# EAGLE schematic SparkFun_IMU_Breakout_ICM-20948_v1 (EAGLE 9.7.0)
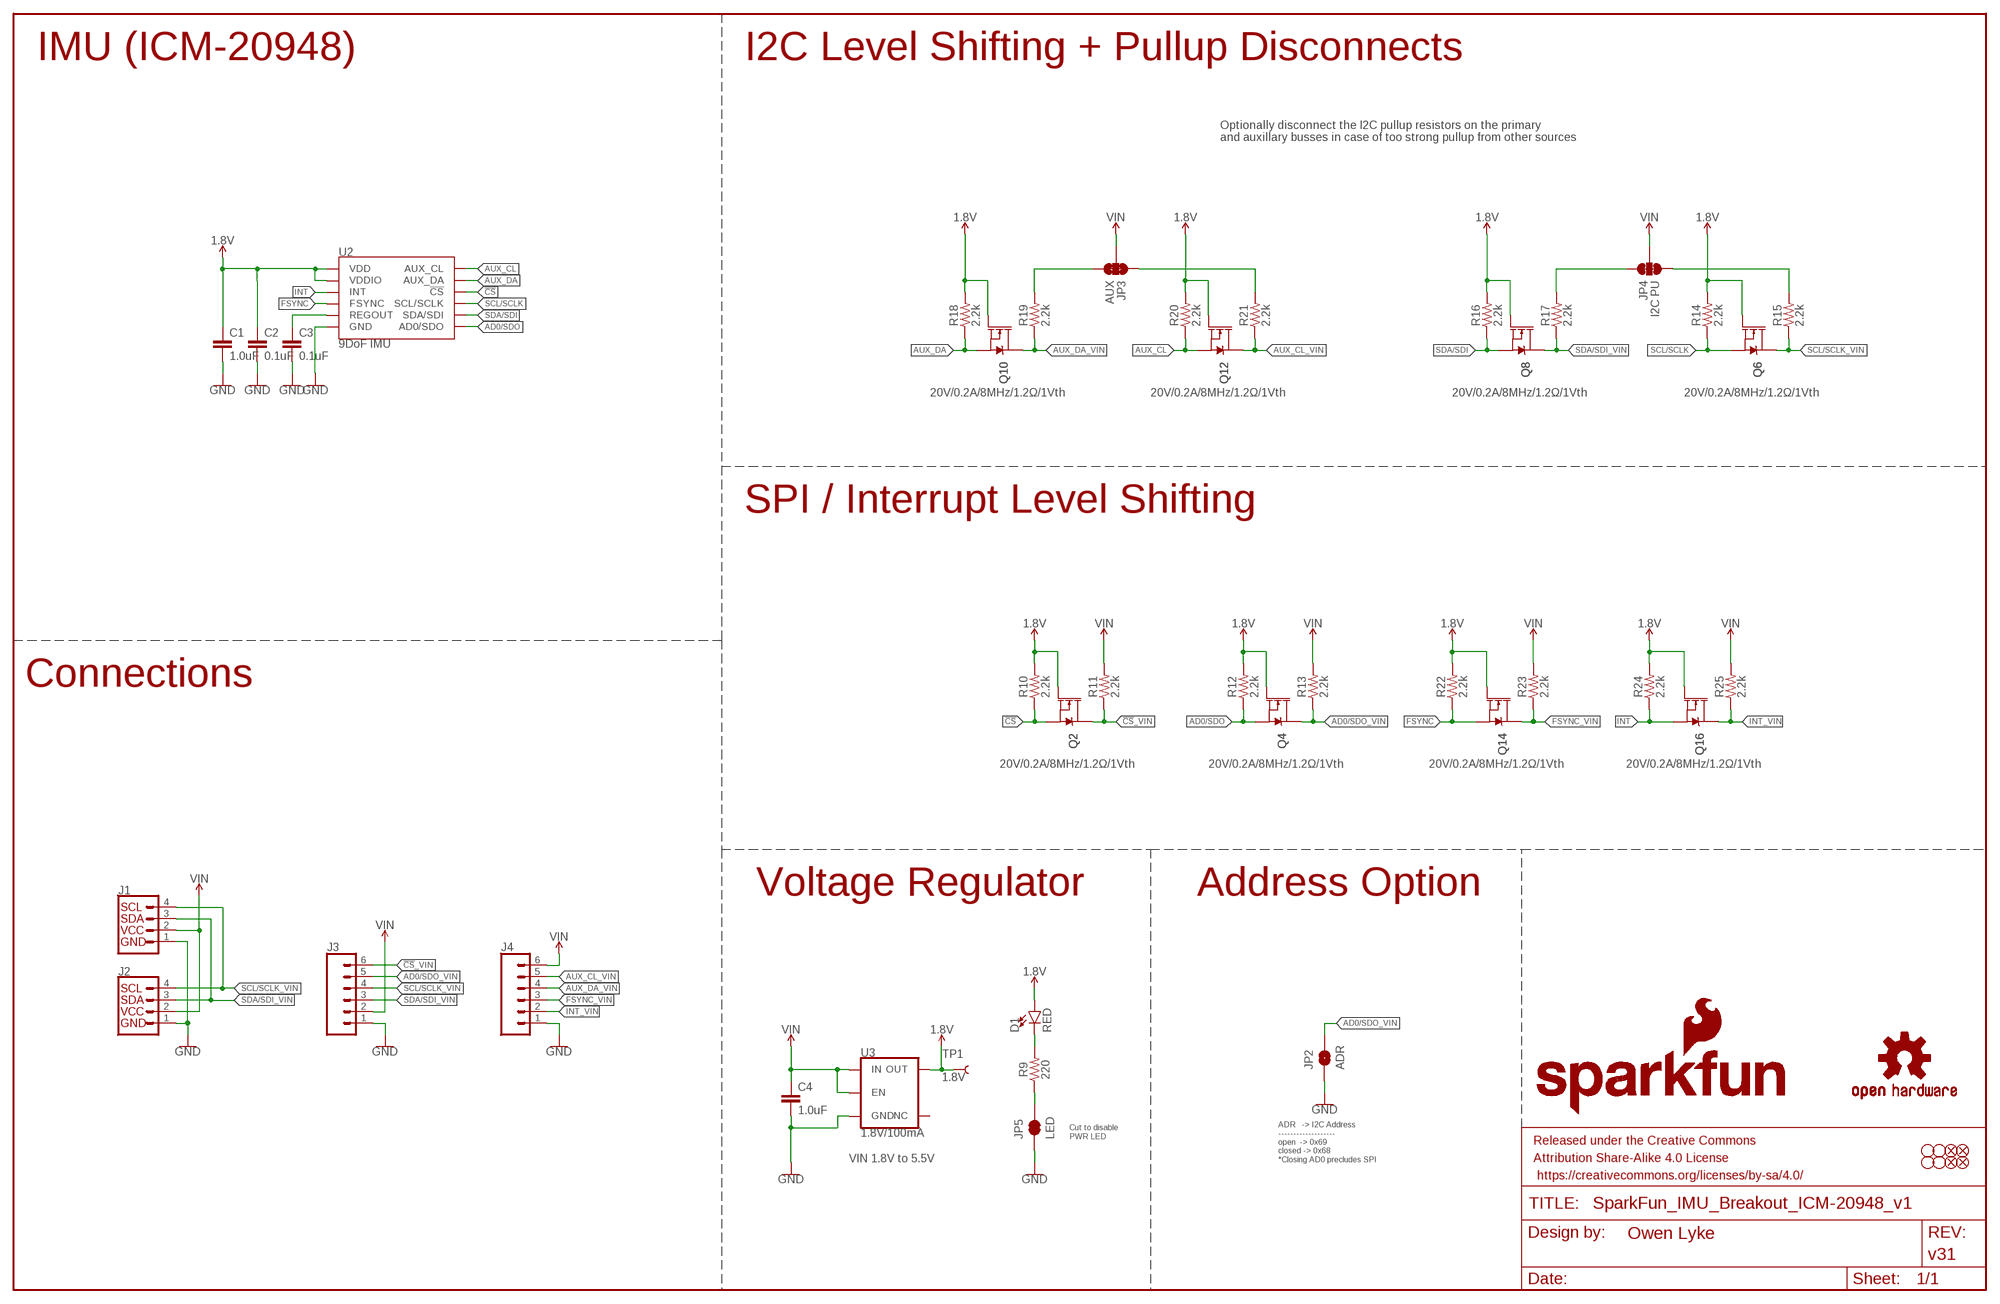
[diagram p0: schematic, sheet 1]

## Parts
C1  1.0uF  1.0UF-0603-16V-10%-X7R  [0603]
C2  0.1uF  0.1UF-0603-25V-5%  [0603]
C3  0.1uF  0.1UF-0603-25V-5%  [0603]
C4  1.0uF  1.0UF-0603-16V-10%-X7R  [0603]
D1  RED  LED-RED0603  [LED-0603]
FD1  FIDUCIAL1X2  [FIDUCIAL-1X2]
FD2  FIDUCIAL1X2  [FIDUCIAL-1X2]
FD3  FIDUCIAL1X2  [FIDUCIAL-1X2]
FD4  FIDUCIAL1X2  [FIDUCIAL-1X2]
FRAME2  FRAME-LEDGER  [CREATIVE_COMMONS]
H1  STAND-OFF  [STAND-OFF]
H2  STAND-OFF  [STAND-OFF]
H3  STAND-OFF  [STAND-OFF]
H4  STAND-OFF  [STAND-OFF]
J1  QWIIC_CONNECTORJS-1MM  [JST04_1MM_RA]
J2  QWIIC_CONNECTORJS-1MM  [JST04_1MM_RA]
J3  CONN_06NO_SILK_NO_POP  [1X06_NO_SILK]
J4  CONN_06NO_SILK_NO_POP  [1X06_NO_SILK]
JP2  ADR  JUMPER-SMT_2_NO_SILK  [SMT-JUMPER_2_NO_SILK]
JP3  AUX  JUMPER-SMT_3_2-NC_TRACE_SILK  [SMT-JUMPER_3_2-NC_TRACE_SILK]
JP4  I2C PU  JUMPER-SMT_3_2-NC_TRACE_SILK  [SMT-JUMPER_3_2-NC_TRACE_SILK]
JP5  LED  JUMPER-SMT_2_NC_TRACE_SILK  [SMT-JUMPER_2_NC_TRACE_SILK]
LOGO1  SFE_LOGO_NAME_FLAME.1_INCH  [SFE_LOGO_NAME_FLAME_.1]
LOGO2  OSHW-LOGOMINI  [OSHW-LOGO-MINI]
Q2  20V/0.2A/8MHz/1.2Ω/1Vth  MOSFET-NCH-RE1C002UN  [SOT-416FL]
Q4  20V/0.2A/8MHz/1.2Ω/1Vth  MOSFET-NCH-RE1C002UN  [SOT-416FL]
Q6  20V/0.2A/8MHz/1.2Ω/1Vth  MOSFET-NCH-RE1C002UN  [SOT-416FL]
Q8  20V/0.2A/8MHz/1.2Ω/1Vth  MOSFET-NCH-RE1C002UN  [SOT-416FL]
Q10  20V/0.2A/8MHz/1.2Ω/1Vth  MOSFET-NCH-RE1C002UN  [SOT-416FL]
Q12  20V/0.2A/8MHz/1.2Ω/1Vth  MOSFET-NCH-RE1C002UN  [SOT-416FL]
Q14  20V/0.2A/8MHz/1.2Ω/1Vth  MOSFET-NCH-RE1C002UN  [SOT-416FL]
Q16  20V/0.2A/8MHz/1.2Ω/1Vth  MOSFET-NCH-RE1C002UN  [SOT-416FL]
R9  220  220OHM-0603-1/10W-1%  [0603]
R10  2.2k  2.2KOHM-0402T-1/16W-1%  [0402-TIGHT]
R11  2.2k  2.2KOHM-0402T-1/16W-1%  [0402-TIGHT]
R12  2.2k  2.2KOHM-0402T-1/16W-1%  [0402-TIGHT]
R13  2.2k  2.2KOHM-0402T-1/16W-1%  [0402-TIGHT]
R14  2.2k  2.2KOHM-0402T-1/16W-1%  [0402-TIGHT]
R15  2.2k  2.2KOHM-0402T-1/16W-1%  [0402-TIGHT]
R16  2.2k  2.2KOHM-0402T-1/16W-1%  [0402-TIGHT]
R17  2.2k  2.2KOHM-0402T-1/16W-1%  [0402-TIGHT]
R18  2.2k  2.2KOHM-0402T-1/16W-1%  [0402-TIGHT]
R19  2.2k  2.2KOHM-0402T-1/16W-1%  [0402-TIGHT]
R20  2.2k  2.2KOHM-0402T-1/16W-1%  [0402-TIGHT]
R21  2.2k  2.2KOHM-0402T-1/16W-1%  [0402-TIGHT]
R22  2.2k  2.2KOHM-0402T-1/16W-1%  [0402-TIGHT]
R23  2.2k  2.2KOHM-0402T-1/16W-1%  [0402-TIGHT]
R24  2.2k  2.2KOHM-0402T-1/16W-1%  [0402-TIGHT]
R25  2.2k  2.2KOHM-0402T-1/16W-1%  [0402-TIGHT]
TP1  1.8V  TEST-POINT3  [PAD.03X.03]
U2  9DoF IMU  ICM-20948  [QFN24-3X3]
U3  1.8V/100mA  V_REG_SP6214-1.8V  [SC70]

## Nets
1.8V: C1.1 C2.1 D1.A Q2.1(G) Q4.1(G) Q6.1(G) Q8.1(G) Q10.1(G) Q12.1(G) Q14.1(G) Q16.1(G) R10.2 R12.2 R14.2 R16.2 R18.2 R20.2 R22.2 R24.2 TP1.P$1 U2.8(VDDIO) U2.13(VDD) U3.5(OUT)
!CS: Q2.2(S) R10.1 U2.22(!CS)
!CS!_VIN: J3.6 Q2.3(D) R11.1
AD0/SDO: Q4.2(S) R12.1 U2.9(AD0/SDO)
AD0/SDO_VIN: J3.5 JP2.2 Q4.3(D) R13.1
AUX_CL: Q12.2(S) R20.1 U2.7(AUX_CL)
AUX_CL_VIN: J4.5 Q12.3(D) R21.1
AUX_DA: Q10.2(S) R18.1 U2.21(AUX_DA)
AUX_DA_VIN: J4.4 Q10.3(D) R19.1
FSYNC: Q14.2(S) R22.1 U2.11(FSYNC)
FSYNC_VIN: J4.3 Q14.3(D) R23.1
GND: C1.2 C2.2 C3.2 C4.2 J1.1 J2.1 J3.1 J4.1 JP2.1 JP5.1 U2.18(GND) U2.20(GND) U3.2(GND)
INT: Q16.2(S) R24.1 U2.12(INT)
INT_VIN: J4.2 Q16.3(D) R25.1
N$1: C3.1 U2.10(REGOUT)
N$2: JP4.3 R15.2
N$3: JP4.1 R17.2
N$4: JP3.1 R21.2
N$5: JP3.3 R19.2
N$9: D1.C R9.2
N$10: JP5.2 R9.1
SCL/SCLK: Q6.2(S) R14.1 U2.23(SCL/SCLK)
SCL/SCLK_VIN: J1.4 J2.4 J3.4 Q6.3(D) R15.1
SDA/SDI: Q8.2(S) R16.1 U2.24(SDA/SDI)
SDA/SDI_VIN: J1.3 J2.3 J3.3 Q8.3(D) R17.1
VIN: C4.1 J1.2 J2.2 J3.2 J4.6 JP3.2 JP4.2 R11.2 R13.2 R23.2 R25.2 U3.1(IN) U3.3(EN)
Unconnected: U3.4(NC)

## Notes on the sheet
- IMU (ICM-20948) | I2C Level Shifting + Pullup Disconnects
- Optionally disconnect the I2C pullup resistors on the primary
  and auxillary busses in case of too strong pullup from other sources
- SPI / Interrupt Level Shifting
- Connections
- Voltage Regulator | Address Option
- Cut to disable
  PWR LED
- VIN 1.8V to 5.5V
- ADR   -> I2C Address
  -------------------
  open  -> 0x69
  closed -> 0x68
  *Closing AD0 precludes SPI

## Library data of the parts
C1 C4 = SparkFun-Capacitors:1.0UF: 1µF ceramic capacitors A capacitor is a passive two-terminal electrical component used to store electrical energy temporarily in an electric field.; PROD_ID: CAP-13930
C2 C3 = SparkFun-Capacitors:0.1UF: 0.1µF ceramic capacitors A capacitor is a passive two-terminal electrical component used to store electrical energy temporarily in an electric field.; PROD_ID: CAP-08604
D1 = SparkFun-LED:LED-RED: Red SMD LED Used in manufacturing of most products at SparkFun Packages: 0603 - SMD 0603 package [Product Link] <http://docs.avagotech.com/docs/AV02-0551EN> 0603 SMART - SMD 0603 SMART package ( more efficient and expensive)[Product Link] <http://www.osram-os.com/Graphics/XPic2/00077099_0.pdf> 1206 - SMD1206 package [Product Link] <https://www.sparkfun.com/datasheets/DevTools/LilyPad/Q150OVS4.pdff> SparkFun Products: Pro Mini 328 -5V <https://www.sparkfun.com/products/821> RedBoard <https://www.sparkfun.com/products/12757> IOIO-OTG <https://www.sparkfun.com/products/13613>; PROD_ID: DIO-00819
FD1-FD4 = SparkFun-Aesthetics:FIDUCIAL: Fiducial Alignment Points Point-of-reference for pick-and-place machines and other optical instruments.
FRAME2 = SparkFun-Aesthetics:FRAME-LEDGER: Schematic Frame - Ledger Standard 11x14 US Ledger frame; DESIGNER: Owen Lyke; REV: v31
H1-H4 = SparkFun-Hardware:STAND-OFF: Stand Off Drill holes for mechanically mounting via screws, standoffs, etc. Note: Use the keepout ring to avoid running the screw head into surrounding components. Variant Overviews STAND-OFF - Mechanical footprint for a #4 phillips button head screw. STAND-OFF-TIGHT - Mechanical footprint for a #4 phillips button head screw, Example SparkFun Products Screw - Phillips Head (1/4", 4-40, 10 pack) <https://www.sparkfun.com/products/10453> (PRT-10453) Screw - Phillips Head (1/2", 4-40, 10 pack) <https://www.sparkfun.com/products/10452> (PRT-10452) Screw - Phillips Head (3/4", 4-40, 10 pack) <https://www.sparkfun.com/products/10451> (PRT-10451) Screw - Phillips Head (1", 4-40, 10 pack) <https://www.sparkfun.com/products/10450> (PRT-10450)
J1 J2 = SparkFun-Connectors:QWIIC_CONNECTOR: SparkFun I2C Standard Qwiic Connector An SMD 1mm pitch JST connector makes it easy and quick (get it? Qwiic?) to connect I2C devices to each other. The Qwiic system <http://www.sparkfun.com/qwiic> enables fast and solderless connection between popular platforms and various sensors and actuators. We carry 200mm <https://www.sparkfun.com/products/14204>, 100mm <https://www.sparkfun.com/products/14205>, 50mm <https://www.sparkfun.com/products/14206>, and breadboard friendly <https://www.sparkfun.com/products/14207> Qwiic cables. We also offer 10 pcs strips <https://www.sparkfun.com/products/14323> the SMD connectors.; PROD_ID: CONN-13694
J3 J4 = SparkFun-Connectors:CONN_06: Multi connection point. Often used as Generic Header-pin footprint for 0.1 inch spaced/style header connections On any of the 0.1 inch spaced packages, you can populate with these: Break Away Headers - Straight <https://www.sparkfun.com/products/116> (PRT-00116) Break Away Male Headers - Right Angle <https://www.sparkfun.com/products/553> (PRT-00553) Female Headers <https://www.sparkfun.com/products/115> (PRT-00115) Break Away Headers - Machine Pin <https://www.sparkfun.com/products/117> (PRT-00117) Break Away Female Headers - Swiss Machine Pin <https://www.sparkfun.com/products/743> (PRT-00743) Arduino Stackable Header - 6 Pin <https://www.sparkfun.com/products/9280> (PRT-09280) For SCREWTERMINALS and SPRING TERMINALS visit here: Screw Terimnals on SparkFun.com <https://www.sparkfun.com/search/results?term=Screw+Terminals> (5mm/3.5mm/2.54mm spacing) This device is also useful as a general connection point to wire up your design to another part of your project. Our various solder wires solder well into these plated through hole pads. Hook-Up Wire - Assortment (Stranded, 22 AWG) <https://www.sparkfun.com/products/11375> (PRT-11375) Hook-Up Wire - Assortment (Solid Core, 22 AWG) <https://www.sparkfun.com/products/11367> (PRT-11367) View the entire wire category on our website here <https://www.sparkfun.com/categories/141>
JP2 = SparkFun-Jumpers:JUMPER-SMT_2_NO: Normally open jumper This jumper has two pads in close proximity to each other. Apply solder to close the connection. Round pads are easier to solder for beginners, but are a lot larger. SparkFun Product that uses the round pads: SparkFun EL Sequencer <https://www.sparkfun.com/products/12781>
JP3 JP4 = SparkFun-Jumpers:JUMPER-SMT_3_2-NC_TRACE: Normally closed trace jumper (2 of 2 connections) This jumper has a trace between all three pads so they are normally closed (NC). Use a razor knife to open the connection(s). For best results follow the IPC guidelines for cutting traces: Cutout at least 0.063 mm (0.005 in). Remove all loose material to clean up the cut area. Seal the cut with an approved epoxy. Reapply solder to reclose the connection(s).
JP5 = SparkFun-Jumpers:JUMPER-SMT_2_NC_TRACE: Normally closed trace jumper This jumper has a trace between two pads so it's normally closed (NC). Use a razor knife to open the connection. For best results follow the IPC guidelines for cutting traces: Cutout at least 0.063 mm (0.005 in). Remove all loose material to clean up the cut area. Seal the cut with an approved epoxy. Reapply solder to reclose the connection.
LOGO1 = SparkFun-Aesthetics:SFE_LOGO_NAME_FLAME: SparkFun Font Logo w/ Flame This is the SparkFun full logo. The logo on the schematic will always be the same size; the package variant is the height of the flame part of the logo. Default layer for the logo on the board is tSilk.
LOGO2 = SparkFun-Aesthetics:OSHW-LOGO: Open-Source Hardware (OSHW) Logo This logo indicates the piece of hardware it is found on incorporates a OSHW license and/or adheres to the definition of open source hardware found here: http://freedomdefined.org/OSHW
Q2 Q4 Q6 Q8 Q10 Q12 Q14 Q16 = SparkFun-DiscreteSemi:MOSFET-NCH: N-channel MOSFETs Voltage controlled devices that allow control of high current outputs. SparkFun Products: SparkFun OpenScale <https://www.sparkfun.com/products/13261> SparkFun Digital Sandbox <https://www.sparkfun.com/products/12651> SparkFun Monster Moto Shield <https://www.sparkfun.com/products/10182> SparkFun MOSFET Power Controller <https://www.sparkfun.com/products/11214>; PROD_ID: TRANS_14399
R9 = SparkFun-Resistors:220OHM: 220Ω resistor A resistor is a passive two-terminal electrical component that implements electrical resistance as a circuit element. Resistors act to reduce current flow, and, at the same time, act to lower voltage levels within circuits. - Wikipedia; PROD_ID: RES-07861
R10-R25 = SparkFun-Resistors:2.2KOHM: 2.2kΩ resistor A resistor is a passive two-terminal electrical component that implements electrical resistance as a circuit element. Resistors act to reduce current flow, and, at the same time, act to lower voltage levels within circuits. - Wikipedia; PROD_ID: RES-14341
TP1 = SparkFun-Connectors:TEST-POINT: SparkFun Test Points Bare copper test points for troubleshooting or In-Circuit-Testing. These are used by our Production team for verifying production board runs using pogo-pins on test beds. SparkFun Products: SparkFun LSM9DS1 Breakout <https://www.sparkfun.com/products/13284> SparkFun PSOC <https://www.sparkfun.com/products/13714> SparkFun Load Cell Amplifier <https://www.sparkfun.com/products/13879>
U2 = SparkFun-Sensors:ICM-20948: ICM-20948 9 Degree of Freedom IMU World’s lowest power 9-axis MotionTracking device that is ideally suited for smartphones, tablets, wearable sensors, and IoT applications. Includes onboard Digital Motion Processor to offload computations from the host processor Datasheet <https://cdn.sparkfun.com/assets/learn_tutorials/5/5/0/MPU9250REV1.0.pdf> SparkFun Products: SparkFun IMU Breakout - ICM-20948 <https://www.sparkfun.com/products/15182>; PROD_ID: IC-14247
U3 = SparkFun-IC-Power:V_REG_SP6214: Voltage Regulator - SP6214 SP6214 Series SC-70-5 Micropower SC-70 100 mA CMOS LDO Regulator Datasheet <https://www.exar.com/content/document.ashx?id=654> SparkFun Products: MP3 Trigger <https://www.sparkfun.com/products/13720> SparkFun Particle Sensor Breakout <https://www.sparkfun.com/products/14045>; PROD_ID: VREG-08428